# EAGLE design zmod4410 (EAGLE 9.6.2)
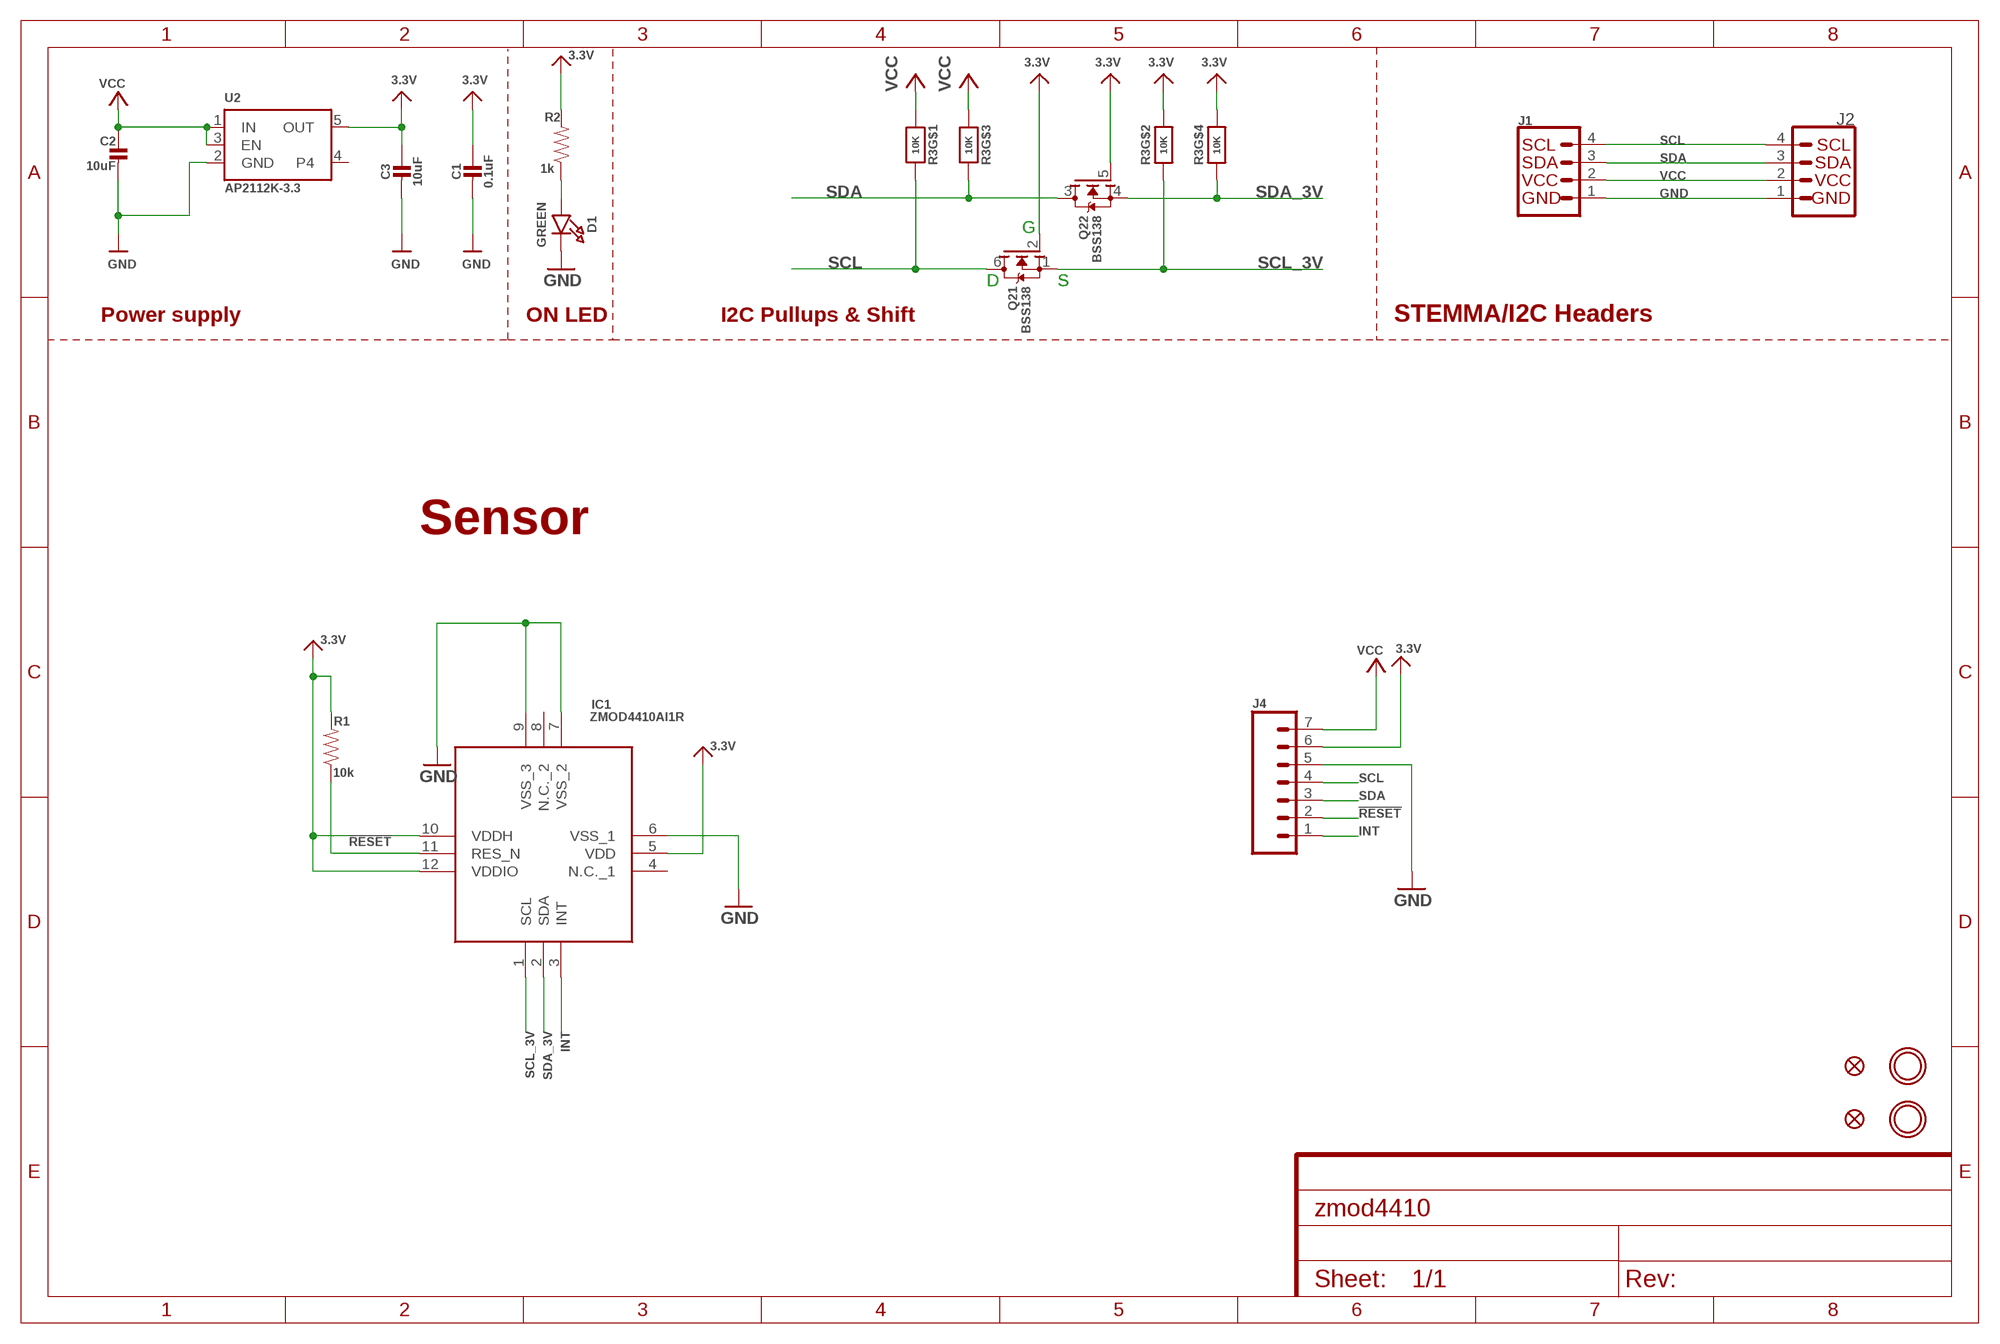
[diagram p0: schematic, sheet 1]

## Parts
C1  0.1uF  CAP_CERAMIC0603_NO  [0603-NO]
C2  10uF  CAP_CERAMIC0805-NOOUTLINE  [0805-NO]
C3  10uF  CAP_CERAMIC0805-NOOUTLINE  [0805-NO]
D1  GREEN  LED0603_NOOUTLINE  [CHIPLED_0603_NOOUTLINE]
FID3  FIDUCIAL_1MM  [FIDUCIAL_1MM]
FID4  FIDUCIAL_1MM  [FIDUCIAL_1MM]
GND  MOUNTINGHOLE2.5  [MOUNTINGHOLE_2.5_PLATED]
IC1  ZMOD4410AI1R  [ZMOD4410AI1R]
J1  QWIIC_CONNECTORJS-1MM  [1X04_1MM_RA]
J2  QWIIC_CONNECTORJS-1MM  [1X04_1MM_RA]
J4  CONN_07  [1X07]
Q2  BSS138  MOSFET-N_DUAL  [SOT363]
R1  10k  1KOHM-0603-1/10W-1%  [0603]
R2  1k  1KOHM-0603-1/10W-1%  [0603]
R3  10K  RESISTOR_4PACK  [RESPACK_4X0603]
U2  AP2112K-3.3  VREG_SOT23-5  [SOT23-5]
U$8  MOUNTINGHOLE2.5  [MOUNTINGHOLE_2.5_PLATED]

## Nets
3.3V [lowpower]: C1.1 C3.1 IC1.5(VDD) IC1.10(VDDH) IC1.12(VDDIO) J4.6 Q2.2(1:G) Q2.5(2:G) R1.2 R2.2 R3.2 R3.4 U2.5(OUT)
!RESET: IC1.11(RES_N) J4.2 R1.1
GND [highpower]: C1.2 C2.2 C3.2 D1.C IC1.6(VSS_1) IC1.7(VSS_2) IC1.9(VSS_3) J1.1 J2.1 J4.5 U2.2(GND)
INT: IC1.3(INT) J4.1
N$1: D1.A R2.1
SCL: J1.4 J2.4 J4.4 Q2.6(1:D) R3.8
SCL_3V: IC1.1(SCL) Q2.1(1:S) R3.7
SDA: J1.3 J2.3 J4.3 Q2.3(2:D) R3.6
SDA_3V: IC1.2(SDA) Q2.4(2:S) R3.5
VCC [highpower]: C2.1 J1.2 J2.2 J4.7 R3.1 R3.3 U2.1(IN) U2.3(EN)
Unconnected: IC1.4(N.C._1) IC1.8(N.C._2) U2.4

## Notes on the sheet
- G
- D | S
- Power supply | ON LED | I2C Pullups & Shift | STEMMA/I2C Headers
- Sensor

## Library data of the parts
C1-C3 = microbuilder:CAP_CERAMIC: Ceramic Capacitors For new designs, use the packages preceded by an '_' character since they are more reliable: The following footprints should be used on most boards: _0402 - Standard footprint for regular board layouts _0603 - Standard footprint for regular board layouts _0805 - Standard footprint for regular board layouts _1206 - Standard footprint for regular board layouts For extremely tight-pitch boards where space is at a premium, the following 'micro-pitch' footprints can be used (smaller pads, no silkscreen outline, etc.): _0402MP - Micro-pitch footprint for very dense/compact boards _0603MP - Micro-pitch footprint for very dense/compact boards _0805MP - Micro-pitch footprint for very dense/compact boards _1206MP - Micro-pitch footprint for very dense/compact boards
D1 = microbuilder:LED: LED 0603 - 0603 Surface Mount Package 2mA: Green LED - Low Power (3.9mcd, 2ma, 1.7Vf) - Digikey: 475-2709-2-ND Orange LED - Low Power (9.8mcd, 2ma, 1.8Vf) - Digikey: 475-1194-2-ND Red LED - Low Power (5mcd, 2ma, 1.8Vf) - Digikey: 475-1195-2-ND Yellow LED - Low Power (7mcd, 2ma, 1.8Vf) - Digikey: 475-1196-2-ND 5mA: Blue LED - Low Power (17mcd, 5ma, 2.9Vf) - Digikey: LNJ937W8CRACT-ND 0805 - 0805 Surface Mount Package 2mA: Red LED (8.8mcd, 2mA, 1.8Vf, Clear) - Low Power [Digikey: 475-2510-1-ND] Green LED (5mcd, 2mA, 1.8Vf, Clear) - Low Power [Digikey: 475-2730-1-ND] Yellow LED (11.3mcd, 2mA, 1.8Vf, Clear) - Low Power [Digikey: 475-2555-1-ND] 20mA: Red LED (104mcd, 20mA, Diffused) - LS R976 [Digikey: 475-1278-6-ND] Red LED (12mcd, 20mA, 2.0Vf, Clear) - APT2012EC [Digikey: 754-1128-1-ND] Green LED (15mcd, 20mA, 2.2Vf, Clear) - APT2012GC [Digikey: 754-1131-1-ND] Orange LED (160mcd, 20mA, 2.1Vf, Clear) - APT2012SECK [Digikey: 754-1130-1-ND] 1206 - 1206 Surface Mount Package Green LED (26mcd, 20mA, Diffused) - LG N971 [Digikey: 475-1407-6-ND] Red LED (15mcd, 20mA, Diffused) - LH N974 [Digikey: 475-1416-6-ND] Cree - Cree High-Power Surface Mount LEDs XPEBWT-L1-0000-00D50 - White 111lm 350mA 2.9Vf 6200K 110° XTEAWT-00-0000-00000LEE3 - White 114lm 350mA 2.85Vf 5000K 115° Everlight - Everlight 45-21 Series Surface Mount LEDs 45-21/QK2C-B2832AC2CB2/2T - Warm White 2000mcd 20mA 3.25Vf 3050K 120° 45-21/LK2C-B38452C4CB2/2T - Nuetral White 2000mcd 20mA 3.25Vf 4150K 120° 45-21/LK2C-B50634C6CB2/2T - Cold White 2200mcd 20mA 3.25Vf 5650K 120° PLCC2 Reverse Mount LS T77K-J1L2-1-0-2-R18-Z - Red 11.25mcd 2mA 1.8Vf 630nm 120° LO T77K-L1M2-24-Z - Orange 19.6mcd 2mA 1.8Vf 606nm 120° LY T77K-K2M1-26-Z - Yellow 15.7mcd 2mA 1.8Vf 587nm 120°
FID3 FID4 = microbuilder:FIDUCIAL: Fiducial Alignment Points Various fiducial points for machine vision alignment.; BOM: EXCLUDE
GND U$8 = microbuilder:MOUNTINGHOLE: Mounting Hole For #2 screws (0.086"/2.18mm width, 0.094"/2.4mm hole) use 2.5mm; BOM: EXCLUDE
IC1 = SamacSys_Parts:ZMOD4410AI1R: LGA 3.0 MM X 3.0 MM X0.7 MM Source: Datasheet <https://www.idt.com/document/dst/zmod4410-datasheet>; DESCRIPTION: LGA 3.0 MM X 3.0 MM X0.7 MM; HEIGHT: 0.77mm; MANUFACTURER_NAME: IDT; MANUFACTURER_PART_NUMBER: ZMOD4410AI1R; MOUSER_PART_NUMBER: 964-ZMOD4410AI1R; MOUSER_PRICE-STOCK: https://www.mouser.com/Search/Refine.aspx?Keyword=964-ZMOD4410AI1R
J1 J2 = SparkFun-Connectors:QWIIC_CONNECTOR: SparkFun I2C Standard Qwiic Connector An SMD 1mm pitch JST connector makes it easy and quick (get it? Qwiic?) to connect I2C devices to each other. The Qwiic system <http://www.sparkfun.com/qwiic> enables fast and solderless connection between popular platforms and various sensors and actuators. We carry 200mm <https://www.sparkfun.com/products/14204>, 100mm <https://www.sparkfun.com/products/14205>, 50mm <https://www.sparkfun.com/products/14206>, and breadboard friendly <https://www.sparkfun.com/products/14207> Qwiic cables. We also offer 10 pcs strips <https://www.sparkfun.com/products/14323> the SMD connectors.; PROD_ID: CONN-13694
J4 = SparkFun-Connectors:CONN_07: Multi connection point. Often used as Generic Header-pin footprint for 0.1 inch spaced/style header connections On any of the 0.1 inch spaced packages, you can populate with these: Break Away Headers - Straight <https://www.sparkfun.com/products/116> (PRT-00116) Break Away Male Headers - Right Angle <https://www.sparkfun.com/products/553> (PRT-00553) Female Headers <https://www.sparkfun.com/products/115> (PRT-00115) Break Away Headers - Machine Pin <https://www.sparkfun.com/products/117> (PRT-00117) Break Away Female Headers - Swiss Machine Pin <https://www.sparkfun.com/products/743> (PRT-00743) For SCREWTERMINALS and SPRING TERMINALS visit here: Screw Terimnals on SparkFun.com <https://www.sparkfun.com/search/results?term=Screw+Terminals> (5mm/3.5mm/2.54mm spacing) This device is also useful as a general connection point to wire up your design to another part of your project. Our various solder wires solder well into these plated through hole pads. Hook-Up Wire - Assortment (Stranded, 22 AWG) <https://www.sparkfun.com/products/11375> (PRT-11375) Hook-Up Wire - Assortment (Solid Core, 22 AWG) <https://www.sparkfun.com/products/11367> (PRT-11367) View the entire wire category on our website here <https://www.sparkfun.com/categories/141> Special notes: Molex polarized connector foot print use with SKU : PRT-08231 with associated crimp pins and housings. 1MM SMD Version SKU: PRT-10208 NOTES ON THE VARIANTS LOCK and LOCK_LONGPADS... This footprint was designed to help hold the alignment of a through-hole component (i.e. 6-pin header) while soldering it into place. You may notice that each hole has been shifted either up or down by 0.005 of an inch from it's more standard position (which is a perfectly straight line). This slight alteration caused the pins (the squares in the middle) to touch the edges of the holes. Because they are alternating, it causes a "brace" to hold the component in place. 0.005 has proven to be the perfect amount of "off-center" position when using our standard breakaway headers. Although looks a little odd when you look at the bare footprint, once you have a header in there, the alteration is very hard to notice. Also,if you push a header all the way into place, it is covered up entirely on the bottom side.
Q2 = microbuilder:MOSFET-N_DUAL: Dual N-Channel MOSFET SOT363 (2.0x1.25mm) 2N7002PS - 60V, 320mA [Digikey: 568-5984-1-ND]
R1 = SparkFun-Resistors:1KOHM: 1kΩ resistor A resistor is a passive two-terminal electrical component that implements electrical resistance as a circuit element. Resistors act to reduce current flow, and, at the same time, act to lower voltage levels within circuits. - Wikipedia; PROD_ID: RES-07856; VALUE: 1k
R2 = SparkFun-Resistors:1KOHM: 1kΩ resistor A resistor is a passive two-terminal electrical component that implements electrical resistance as a circuit element. Resistors act to reduce current flow, and, at the same time, act to lower voltage levels within circuits. - Wikipedia; PROD_ID: RES-07856
R3 = microbuilder:RESISTOR_4PACK: Resistor Packs (4 resistors) 4 x 0603 10K 1/16W - Digikey: YC164J-10KCT-ND
U2 = microbuilder:VREG_SOT23-5: SOT23-5 Fixed Voltage Regulators Part Current Out V Out V In V Dropout θJA (°C/W) TJ (°C) Digikey Part No. ADP121 150mA 3.3V 3.4-5.5V 0.09V @ 150mA -- -- ADP121-AUJZ33R7CT-ND ADP121 150mA 3.0V 3.1-5.5V 0.09V @ 150mA -- -- ADP121-AUJZ30R7CT-ND ADP122 300mA 3.3V 3.4-5.5V 0.085V @ 300mA -- -- ADP122AUJZ-3.3-R7CT-ND ADP1712 300mA 3.3V 3.5-5.5V 0.17V @ 300mA -- -- ADP1712AUJZ-3.3-R7TR-ND AP7311 (Low Cost) 150mA 3.3V 3.5-6V 0.15V @ 150mA -- -- AP7311-33WG-7DICT-ND LD39015M18R 150mA 1.8V 1.9V-5.5V 0.08V @ 100mA -- -- 497-6977-1-ND LP2985A-33DBVR 150mA 3.3V 3.3-16V 0.28V @ 150mA 206 150 296-18479-1-ND MCP1824T-3302E/OT 300mA 3.3V 3.5V-6V 0.2V @ 300mA -- -- MCP1824T-3302E/OTCT-ND MIC5205-2.5YM5 TR 150mA 2.5V 2.7-16V 0.165V @ 150mA -- -- 576-1257-2-ND MIC5205-3.0YM5 TR 150mA 3.0V 3.2V-16V 0.165V @ 150mA -- -- 576-1258-2-ND MIC5205-3.3YM5 TR 150mA 3.3V 3.5V-16V 0.165V @ 150mA -- -- 576-1259-2-ND TPS780330220 150mA 3.3V+2.2V 3.6-5.5V 250mV Max -- -- 296-23332-1-ND TDA3663/N1,135 100mA 3.3V 3.5-45V 0.18V @ 50mA -- -- 568-5343-1-ND Max operating temp can be calculated using θJA, TJ (max junction temperature), and power in watts. Set the "Maximum Ambient Temperature" until it reaches TJ ("Max Junction Temperature"), which is the absolute limit for safe use of the regulator: Heat Sink Temperature Calculator <http://www.daycounter.com/Calculators/Heat-Sink-Temperature-Calculator.phtml> For example, With 12V source into a 3.3V LP2985 and a 30mA load, we are dissipating (12V-3.3V) * 0.03A = 0.261W. With a θJA of 206 °C/W, a TJ of 150°C, and 261mW we can safely use the chip without a heat sink up to 75°C (=147.1°C Junction Temperature).

## Net classes
1 highpower: width 0.254 mm, drill 0.381 mm
2 lowpower: width 0.305 mm, drill 0.381 mm

## Board
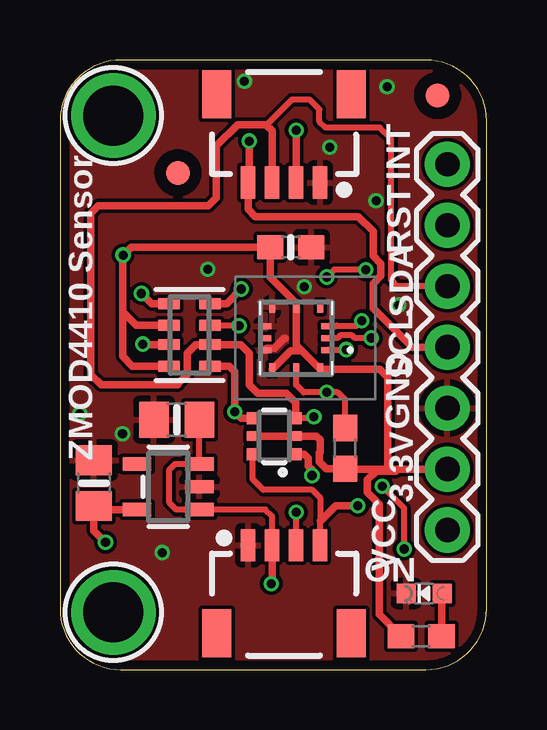
[diagram p1: board, top side]
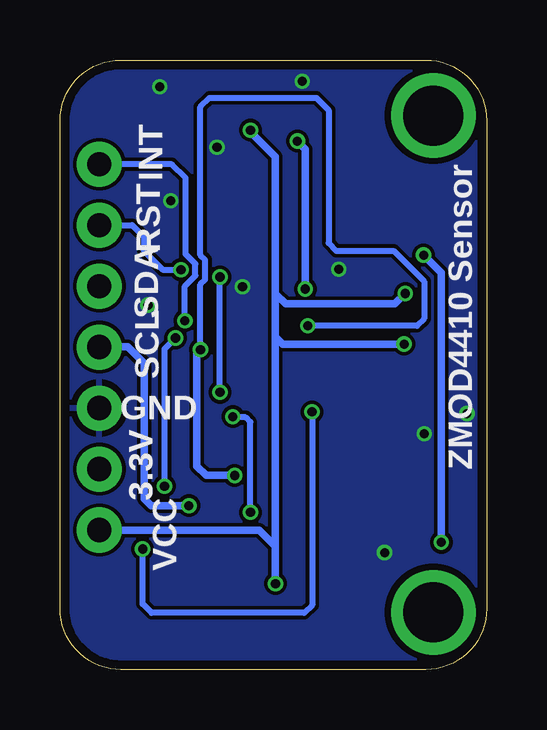
[diagram p2: board, bottom side, seen from below]

Size 17.78 x 25.4 mm. Coordinates in mm from the lower left corner, seen from the top.
Outline: 17.78,2.54 17.78,22.86 arc90 15.24,25.4 2.54,25.4 2.32,25.39 arc85 0,22.86 0,2.54 0.01,2.32 arc85 2.54,0 15.24,0 15.46,0.01 arc85 17.78,2.54
Copper layers (1*16): Top 0.035559375mm / dielectric 1.6mm / Bottom 0.035559375mm
Design rules "oshpark-2layer": minimum track width 6mil, minimum drill 10mil, track to track 6mil, track to pad 6mil, pad to pad 6mil, via to via 6mil, smd to smd 6mil, copper to edge 15mil, drill to drill 6mil, minimum pad ring 5mil, minimum via ring 5mil, stop-mask expansion 2.5mil, vias tented up to drill 0mil, thermal gap 10mil

### Footprints (pad centres in the part's own frame; a part is rotated, then mirrored left to right if it is on the bottom)
0603-NO = smd 1.075 x 1: 1 -0.85,0; 2 0.85,0
0805-NO = smd 1.24 x 1.5: 1 -0.95,0; 2 0.95,0
CHIPLED_0603_NOOUTLINE = smd 0.8 x 0.8: A 0,-0.75; C 0,0.75
FIDUCIAL_1MM = smd 1 x 1: 1 0,0
MOUNTINGHOLE_2.5_PLATED = drill 2.5 pad 3.2: P$1 0,0
ZMOD4410AI1R = smd 0.25 x 0.5: 1 -0.5,-1.3; 2 0,-1.3; 3 0.5,-1.3; 7 0.5,1.3; 8 0,1.3; 9 -0.5,1.3 | smd 0.5 x 0.25: 4 1.3,-1; 5 1.3,0; 6 1.3,1; 10 -1.3,1; 11 -1.3,0; 12 -1.3,-1
1X04_1MM_RA = smd 0.6 x 1.35: 1 -1.5,0; 2 -0.5,0; 3 0.5,0; 4 1.5,0 | smd 1.2 x 2: NC1 2.8,-3.675; NC2 -2.8,-3.675
1X07 = drill 1.016 pad 1.88: 1 0,0; 2 2.54,0; 3 5.08,0; 4 7.62,0; 5 10.16,0; 6 12.7,0; 7 15.24,0
SOT363 = smd 0.5 x 0.5: 1 -0.75,-0.9; 3 0.75,-0.9; 4 0.75,0.9; 6 -0.75,0.9 | smd 0.4 x 0.5: 2 0,-0.9; 5 0,0.9
0603 = smd 1.1 x 1: 1 -0.85,0; 2 0.85,0
RESPACK_4X0603 = smd 0.45 x 0.9: 1 -1.3,-0.85; 2 -0.4,-0.85; 3 0.4,-0.85; 4 1.3,-0.85; 5 1.3,0.85; 6 0.4,0.85; 7 -0.4,0.85; 8 -1.3,0.85
SOT23-5 = smd 0.55 x 1.2: 1 -0.95,-1.3; 2 0,-1.3; 3 0.95,-1.3; 4 0.95,1.3; 5 -0.95,1.3

### Placement (x,y rotation side)
C1  9.61,17.6 0 top
C2  4.87,10.41 180 top
C3  1.41,7.77 90 top
D1  15.18,3.17 90 top
FID3  15.74,23.93 0 top
FID4  4.92,20.7 0 top
GND  2.22,23.09 0 top
IC1  9.84,13.82 90 top
J1  9.34,5.18 0 top
J2  9.34,20.29 180 top
J4  16.14,21.05 270 top
Q2  8.93,9.73 90 top
R1  11.88,9.22 270 top
R2  15.05,1.4 180 top
R3  5.4,13.94 270 top
U2  4.51,7.62 90 top
U$8  2.22,2.39 0 top

### Tracks (layer width: path | path; a pad name or v marks a point on that pad's centre or on a via)
3.3V  (via drill 0.38)
  Top 0.305: Q2.5 Q2.2 10.68,9.73 10.83,9.57 10.83,9.07 10.81,9.04 10.81,8.66 11.1,8.37 R1.2 11.89,8.36 13.65,8.36 | U2.5 1.56,6.67 C3.1 1.41,5.79 v1.89,5.31 | IC1.10 9.61,13.28 10.08,13.28 | 10.08,13.28 IC1.12 13.32,12.52 13.65,12.19 13.65,8.36 | 10.08,13.28 9.84,13.52 IC1.5 9.84,15.26 8.76,16.34 C1.1 2.96,17.6 v2.63,17.27 2.6,17.25 2.6,14.91 | R3.2 3.17,14.34 2.6,14.91 | R3.4 3.02,12.64 2.6,13.05 2.6,14.91 | J4.6 14.09,8.36 | 14.09,8.36 13.65,8.36 | R2.2 13.3,2.3 13.3,6.89 12.8,7.39 12.8,7.9 13.17,8.27 14,8.27 14.09,8.36
  Bottom 0.305: v1.89,5.31 1.89,16.53 v2.63,17.27
!RESET  (via drill 0.38)
  Top 0.254: IC1.11 9.84,11.86 10.15,11.55 v11.11,11.55 11.57,11.55 11.88,11.25 R1.1 | v12.74,16.66 11.42,16.66 v11.11,16.36
  Bottom 0.254: v11.11,11.55 v11.11,16.36 | J4.2 14.77,18.52 14.29,18.03 14.29,17.45 13.5,16.66 v12.74,16.66
GND  (via drill 0.38)
  Top 0.305: IC1.9 8.61,13.39 8.92,13.39 9.35,13.82 9.39,13.82
  other vias: 11.24,21.77 6.16,16.69 2.6,9.83 10.17,15.95 0.83,10.67 4.26,4.88 13.63,24.28 14.11,15.19 7.68,24.51 13.17,19.53
  pour Top: -0.32,-0.15 -0.32,25.25 18.73,25.25 18.73,-0.15
  pour Bottom: -0.32,-0.15 -0.32,25.25 18.73,25.25 18.73,-0.15
INT  (via drill 0.38)
  Top 0.254: IC1.3 11.49,14.32 11.51,14.34 12.37,14.34 v12.58,14.54
  Bottom 0.254: J4.1 13.12,21.05 12.55,20.49 12.55,17.32 12.14,16.91 12.14,16.41 12.58,15.98 v12.58,14.54
N$1
  Top 0.305: R2.1 15.9,3.15 D1.A
SCL  (via drill 0.38)
  Top 0.254: J1.4 10.84,6.2 10.84,7.16 10.5,7.49 8.47,7.49 8.03,7.93 Q2.6
  Top 0.305: R3.8 6.94,15.24 v7.56,15.86 | v7.89,22.02 7.89,20.34 J2.4 7.84,19.18 8.14,18.87 12.43,18.87 13.04,18.26 13.04,17.24 13.36,16.92 13.36,16.4 13.04,16.09 13.04,15.06 14.67,13.44 J4.4 | 10.84,6.2 10.86,6.2 11.49,6.83 v12.41,6.83
  Bottom 0.305: v7.56,15.86 7.56,21.69 v7.89,22.02 | v12.41,6.83 13.98,6.83 14.26,7.11 14.26,12.78 14.95,13.46 16.12,13.46 J4.4
SCL_3V  (via drill 0.38)
  Top 0.254: IC1.1 11.16,13.33 v11.93,13.33 | v7.46,14.32 6.27,14.32 R3.7
  Top 0.305: Q2.1 10.19,8.98 10.35,8.81 10.35,8.47 10.5,8.32 v10.5,8.09
  Bottom 0.254: v7.46,14.32 2.91,14.32 2.6,14.63 2.6,16.18 3.87,17.45 6.26,17.45 6.59,17.78 6.59,23.32 7.1,23.82 11.55,23.82 11.93,23.44 11.93,17.27 11.74,17.08 11.74,16.25 11.93,16.05 v11.93,13.33
  Bottom 0.305: v10.5,8.09 11.69,8.09 12.08,8.48 12.08,13.18 v11.93,13.33
SDA  (via drill 0.38)
  Top 0.254: J1.3 9.84,6.54 v9.84,6.55 | v10.58,10.54 10.52,10.48 Q2.3 | J4.3 14.06,15.98 13.79,16.24 13.79,22.11 13.32,22.58 11.06,22.58 10.81,22.83 10.81,23.34 10.4,23.75 9.67,23.75 8.6,22.68
  Top 0.305: J2.3 8.84,22.44 8.6,22.68 8.57,22.71 7.41,22.71 6.52,21.82 6.52,19.66 6.19,19.33 1.59,19.33 1.28,19.02 1.28,12.29 1.72,11.86 4.92,11.86 4.92,11.9 5.3,12.29 5.3,13.19 5.66,13.54 R3.6 7.53,13.54 7.89,13.18 7.89,11.86 8.24,11.51 9.44,11.51 9.83,11.11 Q2.3
  Bottom 0.254: v9.84,6.55 9.84,10.31 10.05,10.51 10.55,10.51 v10.58,10.54
SDA_3V  (via drill 0.38)
  Top 0.254: v14.34,5.03 14.34,6.73 v13.42,7.64 | v12.97,13.82 12.29,13.82 12.17,13.93 11.68,13.93 11.56,13.82 IC1.2
  Top 0.305: Q2.4 7.54,10.48 v7.28,10.74 7.28,12.42 7.05,12.65 R3.5
  Bottom 0.254: v7.28,10.74 7.28,2.69 7.61,2.36 13.96,2.36 14.34,2.74 v14.34,5.03 | v13.42,7.64 13.42,13.36 v12.97,13.82
VCC  (via drill 0.38)
  Top 0.254: J1.2 8.84,6.39 8.56,6.67 U2.1 4.85,6.67 4.56,6.96 4.56,8.33 4.8,8.57 U2.3 C2.1
  Top 0.305: J1.2 8.84,3.61 v8.8,3.58 | v9.84,22.48 J2.2 | R3.3 3.46,13.54 v3.44,13.56 | R3.1 3.82,15.24 v3.39,15.67
  Bottom 0.305: v8.8,3.58 8.8,5.13 | 8.8,5.13 8.8,13.87 | 8.8,13.87 8.8,15.67 | 8.8,15.67 8.8,21.36 9.84,22.4 v9.84,22.48 | J4.7 9.49,5.82 8.8,5.13 | v3.44,13.56 8.5,13.56 8.8,13.87 | v3.39,15.67 3.82,15.24 8.37,15.24 8.8,15.67

### Text on the board
tPlace: INT | RST | SDA | SCL | 3.3V | GND | ZMOD4410 Sensor | VCC | ON
bPlace: INT | ZMOD4410 Sensor | RST | SDA | SCL | GND | 3.3V | VCC